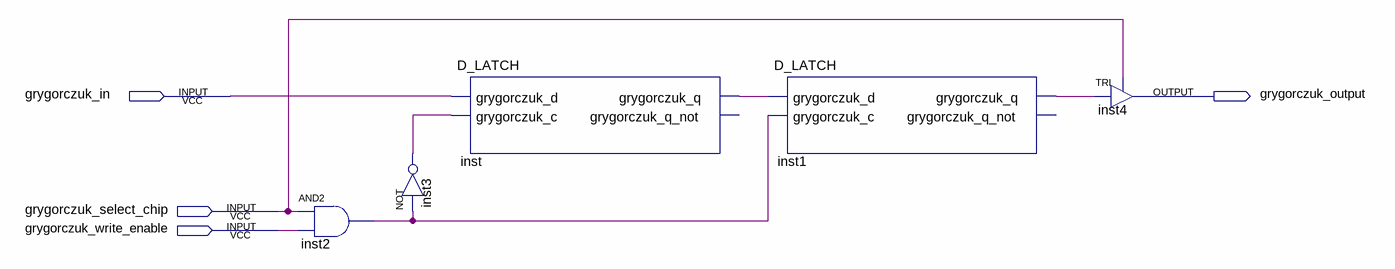
[diagram p0: schematic sheet]
// Quartus schematic SRAM.bdf as structural Verilog: 5 symbols, 4 pins
module SRAM (
  input  grygorczuk_in,
  input  grygorczuk_select_chip,
  input  grygorczuk_write_enable,
  output grygorczuk_output
);

  wire inst1_grygorczuk_q, inst2_out, inst3_out, inst_grygorczuk_q;

  and inst2 (inst2_out, grygorczuk_select_chip, grygorczuk_write_enable);
  D_LATCH inst (
    .grygorczuk_d(grygorczuk_in), .grygorczuk_c(inst3_out), .grygorczuk_q(inst_grygorczuk_q));  // open: grygorczuk_q_not
  not inst3 (inst3_out, inst2_out);
  D_LATCH inst1 (
    .grygorczuk_d(inst_grygorczuk_q), .grygorczuk_c(inst2_out), .grygorczuk_q(inst1_grygorczuk_q));  // open: grygorczuk_q_not
  TRI inst4 (.IN(inst1_grygorczuk_q), .OE(grygorczuk_select_chip), .OUT(grygorczuk_output));
endmodule
